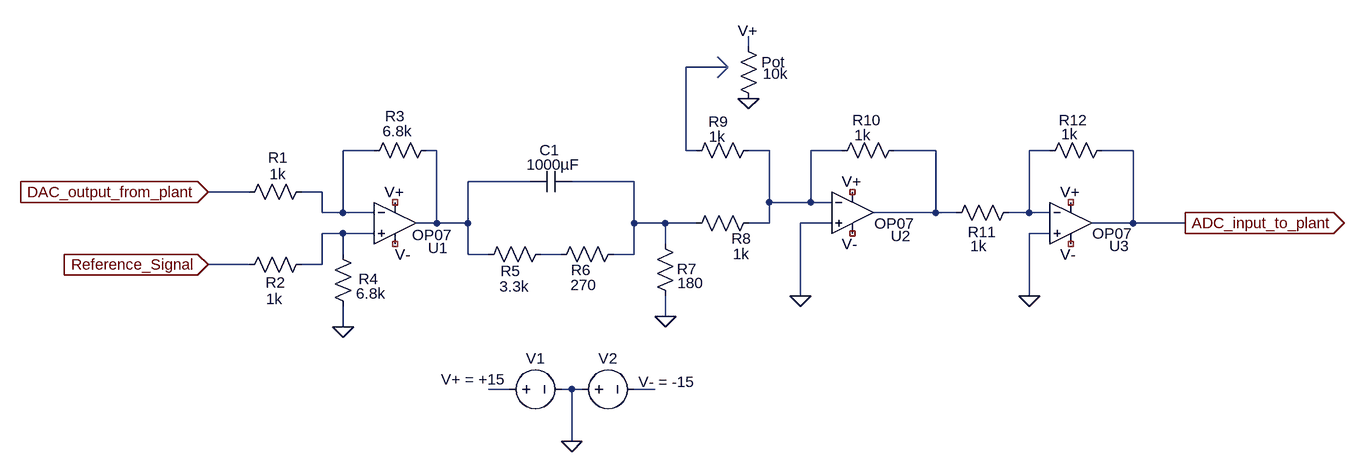
[diagram p0: schematic Controller_design.asc]
Controller_design.asc, the LTspice schematic file:
Version 4
SHEET 1 896 680
WIRE -64 -128 -64 -144
WIRE -96 -96 -160 -96
WIRE -640 32 -688 32
WIRE -544 32 -560 32
WIRE -160 32 -160 -96
WIRE -144 32 -160 32
WIRE -32 32 -64 32
WIRE 80 32 32 32
WIRE 224 32 160 32
WIRE 400 32 368 32
WIRE 528 32 480 32
WIRE -400 80 -496 80
WIRE -240 80 -336 80
WIRE -832 96 -896 96
WIRE -720 96 -752 96
WIRE -32 112 -32 32
WIRE 32 112 32 32
WIRE 32 112 -32 112
WIRE 64 112 32 112
WIRE -720 128 -720 96
WIRE -688 128 -688 32
WIRE -688 128 -720 128
WIRE -640 128 -688 128
WIRE 224 128 224 32
WIRE 224 128 128 128
WIRE 256 128 224 128
WIRE 368 128 368 32
WIRE 368 128 336 128
WIRE 400 128 368 128
WIRE -544 144 -544 32
WIRE -544 144 -576 144
WIRE -496 144 -496 80
WIRE -496 144 -544 144
WIRE -240 144 -240 80
WIRE -192 144 -240 144
WIRE -144 144 -192 144
WIRE -32 144 -32 112
WIRE -32 144 -64 144
WIRE 64 144 16 144
WIRE 528 144 528 32
WIRE 528 144 464 144
WIRE 608 144 528 144
WIRE -688 160 -720 160
WIRE -640 160 -688 160
WIRE 400 160 368 160
WIRE -192 176 -192 144
WIRE -688 192 -688 160
WIRE -496 192 -496 144
WIRE -464 192 -496 192
WIRE -352 192 -384 192
WIRE -240 192 -240 144
WIRE -240 192 -272 192
WIRE -832 208 -896 208
WIRE -720 208 -720 160
WIRE -720 208 -752 208
WIRE 16 256 16 144
WIRE 368 256 368 160
WIRE -192 288 -192 256
WIRE -688 304 -688 272
WIRE -432 400 -464 400
WIRE -336 400 -352 400
WIRE -320 400 -336 400
WIRE -208 400 -240 400
WIRE -336 480 -336 400
FLAG -688 304 0
FLAG -192 288 0
FLAG 16 256 0
FLAG 368 256 0
FLAG -64 -48 0
FLAG -896 208 Reference_Signal
IOPIN -896 208 In
FLAG 608 144 ADC_input_to_plant
IOPIN 608 144 Out
FLAG -896 96 DAC_output_from_plant
IOPIN -896 96 In
FLAG -336 480 0
SYMBOL Opamps\\OP07 -608 80 R0
WINDOW 0 51 102 Left 2
WINDOW 3 26 82 Left 2
SYMATTR InstName U1
SYMBOL Opamps\\OP07 96 64 R0
WINDOW 0 59 100 Left 2
WINDOW 3 34 81 Left 2
SYMATTR InstName U2
SYMBOL Opamps\\OP07 432 80 R0
WINDOW 0 59 99 Left 2
WINDOW 3 33 80 Left 2
SYMATTR InstName U3
SYMBOL res -736 80 R90
WINDOW 0 -21 52 VBottom 2
WINDOW 3 -27 52 VTop 2
SYMATTR InstName R1
SYMATTR Value 1k
SYMBOL res -736 192 R90
WINDOW 0 59 56 VBottom 2
WINDOW 3 53 58 VTop 2
SYMATTR InstName R2
SYMATTR Value 1k
SYMBOL res -544 16 R90
WINDOW 0 -21 64 VBottom 2
WINDOW 3 -29 60 VTop 2
SYMATTR InstName R3
SYMATTR Value 6.8k
SYMBOL res -256 176 R90
WINDOW 0 56 66 VBottom 2
WINDOW 3 48 62 VTop 2
SYMATTR InstName R6
SYMATTR Value 270
SYMBOL res -176 272 R180
WINDOW 0 -33 57 Left 2
WINDOW 3 -43 36 Left 2
SYMATTR InstName R7
SYMATTR Value 180
SYMBOL res -160 160 R270
WINDOW 0 -23 85 VTop 2
WINDOW 3 -16 85 VBottom 2
SYMATTR InstName R8
SYMATTR Value 1k
SYMBOL res -160 48 R270
WINDOW 0 45 50 VTop 2
WINDOW 3 53 48 VBottom 2
SYMATTR InstName R9
SYMATTR Value 1k
SYMBOL res 64 48 R270
WINDOW 0 47 54 VTop 2
WINDOW 3 55 48 VBottom 2
SYMATTR InstName R10
SYMATTR Value 1k
SYMBOL res 240 144 R270
WINDOW 0 -29 56 VTop 2
WINDOW 3 -20 50 VBottom 2
SYMATTR InstName R11
SYMATTR Value 1k
SYMBOL res 496 16 R90
WINDOW 0 -15 60 VBottom 2
WINDOW 3 -25 66 VTop 2
SYMATTR InstName R12
SYMATTR Value 1k
SYMBOL cap -336 64 R90
WINDOW 0 -17 34 VBottom 2
WINDOW 3 -26 28 VTop 2
SYMATTR InstName C1
SYMATTR Value 1000µF
SYMBOL res -704 176 R0
WINDOW 0 40 54 Left 2
SYMATTR InstName R4
SYMATTR Value 6.8k
SYMBOL res -80 -144 R0
WINDOW 3 38 58 Left 2
SYMATTR InstName Pot
SYMATTR Value 10k
SYMBOL res -368 176 R90
WINDOW 0 57 62 VBottom 2
WINDOW 3 50 56 VTop 2
SYMATTR InstName R5
SYMATTR Value 3.3k
SYMBOL voltage -448 400 R270
WINDOW 0 32 56 VTop 2
WINDOW 3 0 -40 VTop 2
SYMATTR InstName V1
SYMATTR Value V+ = +15
SYMBOL voltage -336 400 R270
WINDOW 0 32 56 VTop 2
WINDOW 3 27 146 VBottom 2
SYMATTR InstName V2
SYMATTR Value V- = -15
TEXT -624 96 Left 2 !V+
TEXT 80 80 Left 2 !V+
TEXT 416 96 Left 2 !V+
TEXT -608 192 Left 2 !V-
TEXT 80 176 Left 2 !V-
TEXT 416 192 Left 2 !V-
TEXT -80 -152 Left 2 !V+
LINE Normal -96 -96 -112 -112
LINE Normal -112 -80 -96 -96

The netlist it stands for:
* Controller_design.asc
XU1 N009 N003 NC_01 NC_02 N004 LT1001  ; OP07, pins In+ In- V+ V- OUT
XU2 0 N005 NC_03 NC_04 N006 LT1001  ; OP07, pins In+ In- V+ V- OUT
XU3 0 N007 NC_05 NC_06 ADC_input_to_plant LT1001  ; OP07, pins In+ In- V+ V- OUT
R1 N003 DAC_output_from_plant 1k
R2 N009 Reference_Signal 1k
R3 N004 N003 6.8k
R6 N008 N010 270
R7 0 N008 180
R8 N008 N005 1k
R9 N002 N005 1k
R10 N005 N006 1k
R11 N006 N007 1k
R12 ADC_input_to_plant N007 1k
C1 N008 N004 1000µF
R4 N009 0 6.8k
R§Pot N001 0 10k
R5 N010 N004 3.3k
V1 N011 0 V+ = +15
V2 0 N012 V- = -15
V+
V+
V+
V-
V-
V-
V+
.lib LTC.lib
.backanno
.end